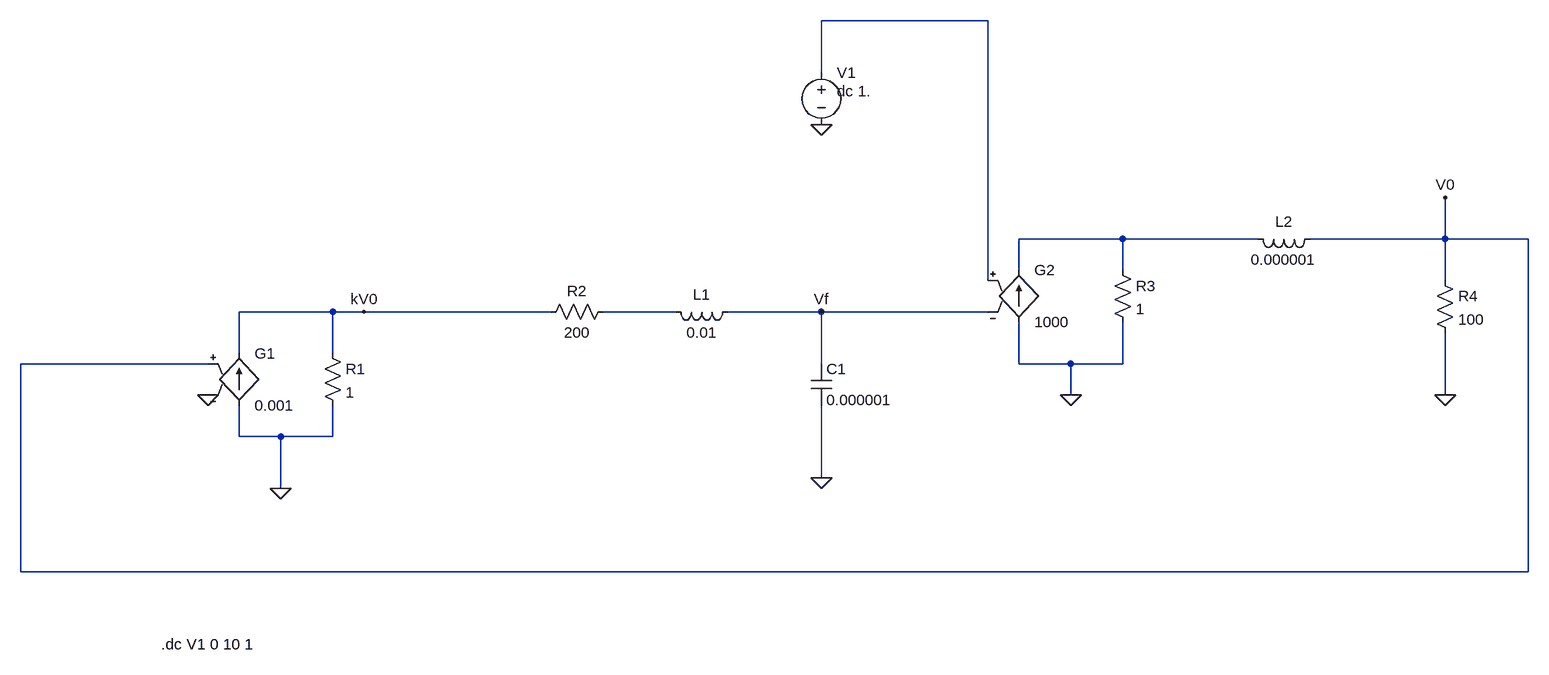
[diagram p0: schematic ee18btech11006.asc]
ee18btech11006.asc, the LTspice schematic file:
Version 4
SHEET 1 1404 680
WIRE 512 -1232 256 -1232
WIRE 256 -1152 256 -1232
WIRE 720 -896 560 -896
WIRE 928 -896 720 -896
WIRE 1216 -896 1216 -960
WIRE 1216 -896 1008 -896
WIRE 1344 -896 1216 -896
WIRE 560 -848 560 -896
WIRE 720 -848 720 -896
WIRE 512 -832 512 -1232
WIRE 1216 -832 1216 -896
WIRE -496 -784 -640 -784
WIRE -448 -784 -496 -784
WIRE -160 -784 -448 -784
WIRE 32 -784 -80 -784
WIRE 256 -784 112 -784
WIRE 512 -784 256 -784
WIRE -640 -720 -640 -784
WIRE -496 -720 -496 -784
WIRE -688 -704 -976 -704
WIRE 256 -704 256 -784
WIRE 560 -704 560 -768
WIRE 640 -704 560 -704
WIRE 720 -704 720 -768
WIRE 720 -704 640 -704
WIRE 640 -656 640 -704
WIRE 1216 -656 1216 -752
WIRE -640 -592 -640 -640
WIRE -576 -592 -640 -592
WIRE -496 -592 -496 -640
WIRE -496 -592 -576 -592
WIRE 256 -528 256 -640
WIRE -576 -512 -576 -592
WIRE -976 -384 -976 -704
WIRE 1344 -384 1344 -896
WIRE 1344 -384 -976 -384
FLAG -688 -656 0
FLAG -576 -512 0
FLAG -448 -784 kV0
FLAG 256 -528 0
FLAG 256 -1072 0
FLAG 640 -656 0
FLAG 1216 -656 0
FLAG 1216 -960 V0
FLAG 256 -784 Vf
SYMBOL g -640 -736 R0
SYMATTR InstName G1
SYMATTR Value 0.001
SYMBOL res -512 -736 R0
SYMATTR InstName R1
SYMATTR Value 1
SYMBOL res -64 -800 R90
WINDOW 0 0 56 VBottom 2
WINDOW 3 32 56 VTop 2
SYMATTR InstName R2
SYMATTR Value 200
SYMBOL ind 128 -800 R90
WINDOW 0 5 56 VBottom 2
WINDOW 3 32 56 VTop 2
SYMATTR InstName L1
SYMATTR Value 0.01
SYMBOL cap 240 -704 R0
SYMATTR InstName C1
SYMATTR Value 0.000001
SYMBOL g 560 -864 R0
SYMATTR InstName G2
SYMATTR Value 1000
SYMBOL voltage 256 -1168 R0
WINDOW 3 24 44 Left 2
WINDOW 123 0 0 Left 2
WINDOW 39 0 0 Left 2
SYMATTR Value dc 1.
SYMATTR InstName V1
SYMBOL res 704 -864 R0
SYMATTR InstName R3
SYMATTR Value 1
SYMBOL ind 1024 -912 R90
WINDOW 0 5 56 VBottom 2
WINDOW 3 32 56 VTop 2
SYMATTR InstName L2
SYMATTR Value 0.000001
SYMBOL res 1200 -848 R0
SYMATTR InstName R4
SYMATTR Value 100
TEXT -760 -272 Left 2 !.dc V1 0 10 1

The netlist it stands for:
* ee18btech11006.asc
G1 0 kV0 V0 0 0.001
R1 kV0 0 1
R2 N003 kV0 200
L1 Vf N003 0.01
C1 Vf 0 0.000001
G2 0 N002 N001 Vf 1000
V1 N001 0 dc 1.
R3 N002 0 1
L2 V0 N002 0.000001
R4 V0 0 100
.dc V1 0 10 1
.backanno
.end